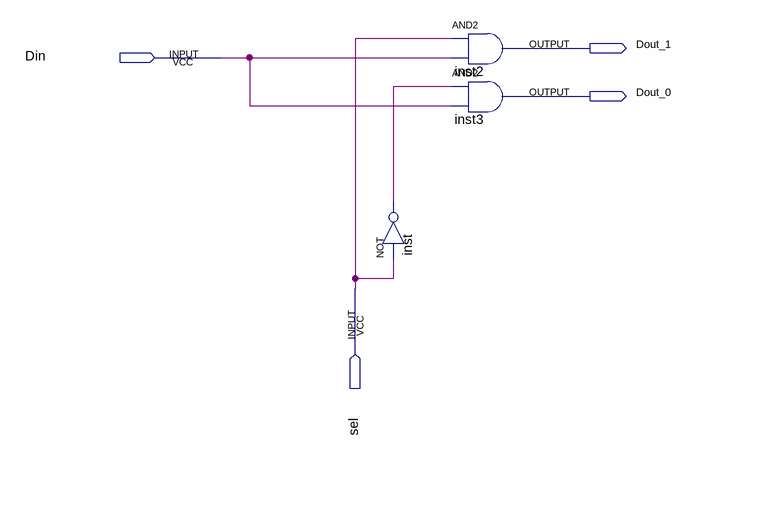
[diagram p0: schematic sheet]
// Quartus schematic demux_1x2.bdf as structural Verilog: 3 symbols, 4 pins
module demux_1x2 (
  input  Din,
  input  sel,
  output Dout_1,
  output Dout_0
);

  wire inst_out;

  not inst (inst_out, sel);
  and inst2 (Dout_1, sel, Din);
  and inst3 (Dout_0, inst_out, Din);
endmodule
